# EAGLE design tinyek (EAGLE 6.5.0)
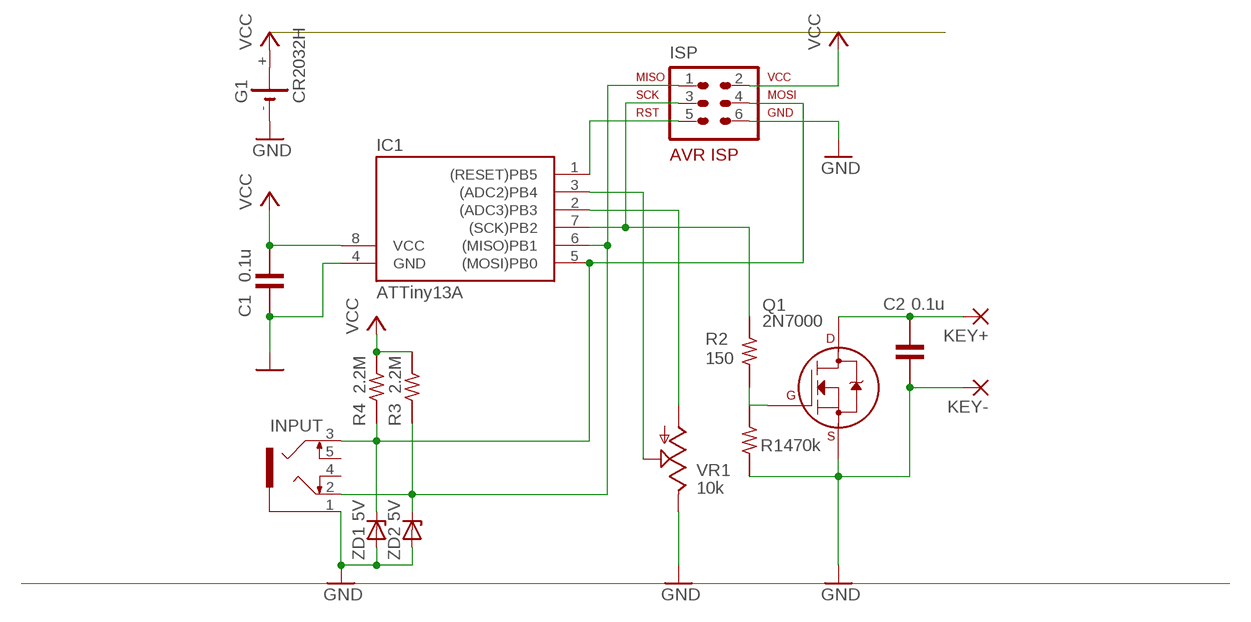
[diagram p0: schematic, sheet 1]

## Parts
C1  0.1u  C-50V-0302-5.08  [50-0302-5.08]
C2  0.1u  C-50V-0302-5.08  [50-0302-5.08]
G1  CR2032H  [CR2032H]
IC1  ATTiny13A  TINY138P3  [DIL08]
INPUT  1503_09  [1503_09]
ISP  AVR-ISP-6VERT  [AVR-ISP-6]
KEY+  2,15/1,0  [2,15/1,0]
KEY-  2,15/1,0  [2,15/1,0]
Q1  2N7000  2N7000_TO92  [TO-92]
R1  470k  R-1/4W-02.54-V  [1/4W-2.54V]
R2  150  R-1/4W-02.54-V  [1/4W-2.54V]
R3  2.2M  R-1/4W-07.62  [1/4W-7.62H]
R4  2.2M  R-1/4W-07.62  [1/4W-7.62H]
VR1  10k  TRIM_US-B25U  [B25U]
ZD1  5V  ZPD  [DO35Z10]
ZD2  5V  ZPD  [DO35Z10]

## Nets
GND: C1.PAD1 C2.PAD2 G1.- IC1.4(GND) INPUT.1 ISP.6 KEY-.1(P) Q1.1(S) R1.PAD2 VR1.E ZD1.A ZD2.A
N$1: IC1.1((RESET)PB5) ISP.5
N$4: IC1.7((SCK)PB2) ISP.3 R2.PAD1
N$5: IC1.2((ADC3)PB3) VR1.A
N$6: IC1.3((ADC2)PB4) VR1.S
N$8: Q1.2(G) R1.PAD1 R2.PAD2
N$9: C2.PAD1 KEY+.1(P) Q1.3(D)
N$10: IC1.5((MOSI)PB0) INPUT.3 ISP.4 R4.PAD2 ZD1.C
N$11: IC1.6((MISO)PB1) INPUT.2 ISP.1 R3.PAD2 ZD2.C
VCC: C1.PAD2 G1.+ IC1.8(VCC) ISP.2 R3.PAD1 R4.PAD1
Unconnected: G1.+@1(+) INPUT.4 INPUT.5

## Library data of the parts
C1 C2 = c-j:C-: CAPACITOR Japanese symbol
G1 = battery:CR2032H: LI BATTERY Varta
IC1 = avr-7:TINY13*
INPUT = con-lumberg:1503_09: Jack connectors according to JISC 6560, 3.5 mm Klinkeneinbaukupplung nach JISC 6560, 3,5 mm, 3-polig/ stereo, abgewinkelte Ausführung, mit 2 Öffnern und Lötaugen, für Leiterplatten Rückseitenmontage Source: http://www.lumberg.com/Produkte/PDFs/1503_09.pdf; OC_FARNELL: 1243244; OC_NEWARK: unknown
ISP = avr-7:AVR-ISP-6: AVR ISP-6 Serial Programming Header
KEY+ KEY- = wirepad:2,15/1,0: THROUGH-HOLE PAD
Q1 = transistors:2N700*: 2N7000, 2N7002, NDS7002A N-channel enhancement mode MOSFET
R1-R4 = r-j:R-: RESISTOR Japanese symbol
VR1 = pot:TRIM_US-: POTENTIOMETER
ZD1 ZD2 = diode:ZPD: Z DIODE 500 mW

## Net classes
0 default: width 0.762 mm

## Board
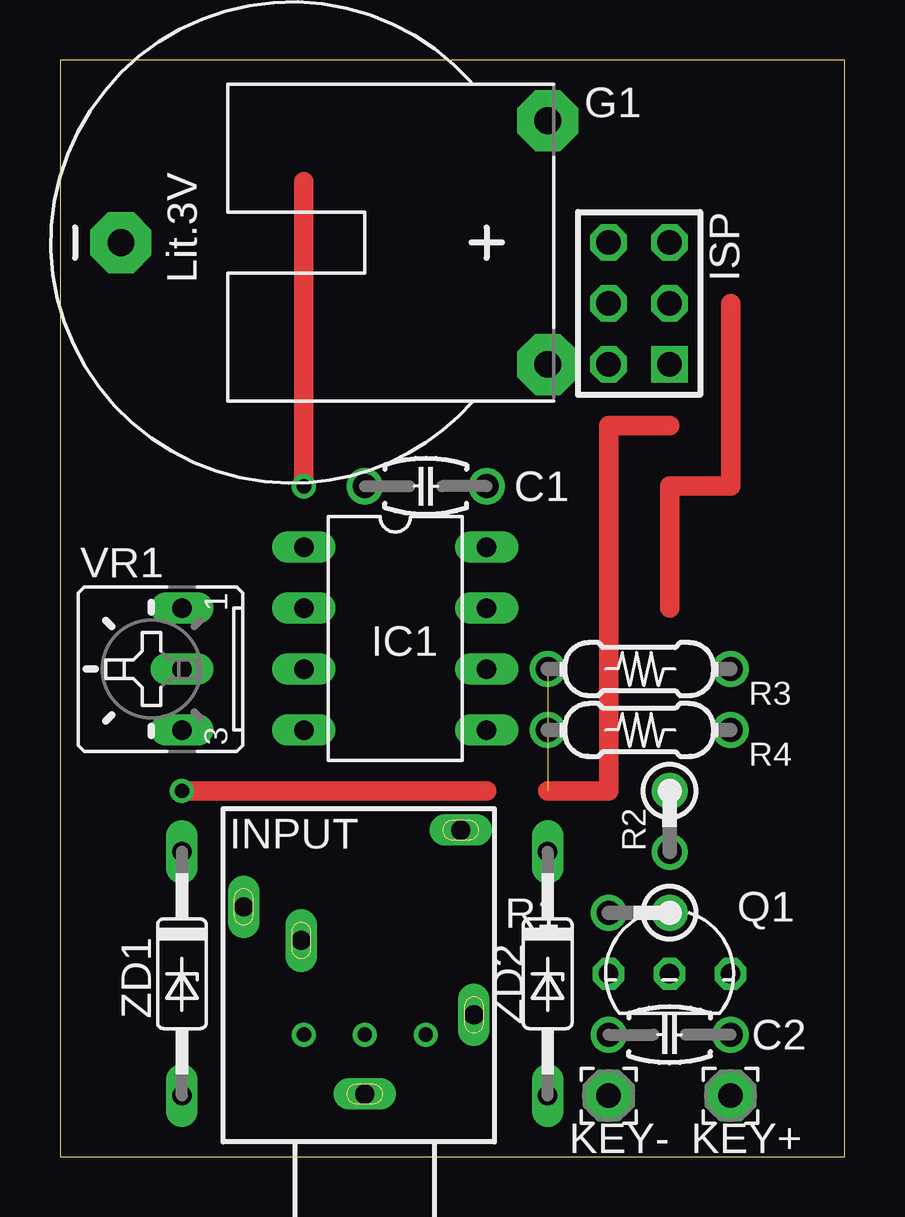
[diagram p1: board, top side]
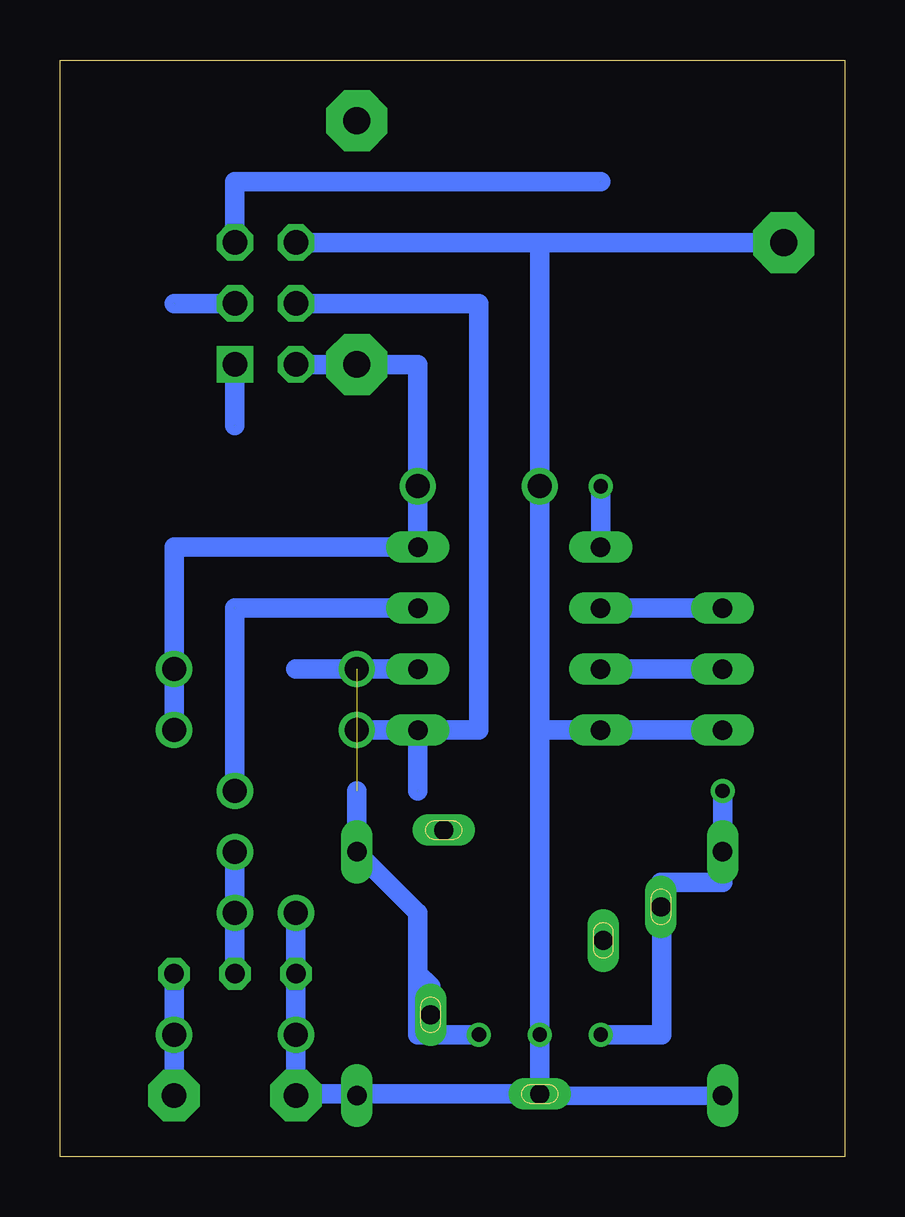
[diagram p2: board, bottom side, seen from below]

Size 32.69 x 45.71 mm. Coordinates in mm from the lower left corner, seen from the top.
Outline: 0,0 32.69,0 32.69,45.71 0,45.71 0,0
Copper layers (1*16): Top 0.035mm / dielectric 1.5mm / Bottom 0.035mm
Design rules "default": minimum track width 10mil, minimum drill 24mil, track to track 8mil, track to pad 8mil, pad to pad 8mil, via to via 8mil, smd to smd 8mil, copper to edge 40mil, drill to drill 8mil, minimum pad ring 10mil, minimum via ring 8mil, stop-mask expansion 4mil, vias tented up to drill 0mil, thermal gap 10mil
tRestrict: area 9.9,17.5 to 10.4,18; area 9.9,20.1 to 10.4,20.6; area 9.9,22.6 to 10.4,23.1; area 9.9,25.1 to 10.4,25.7; area 17.5,25.1 to 18,25.7; area 17.5,22.6 to 18,23.1; area 17.5,20.1 to 18,20.6; area 17.5,17.5 to 18,18; area 20.1,20.1 to 20.6,20.6; area 20.1,17.5 to 20.6,18; area 27.7,17.5 to 28.2,18; area 27.7,20.1 to 28.2,20.6; 258 more areas
bRestrict: area 11.2,11.2 to 11.7,11.7; area 11.2,13.7 to 11.7,14.2; area 13.7,11.2 to 14.2,11.7; area 13.7,13.7 to 14.2,14.2; area 13.7,13.7 to 14.2,14.2; area 16.3,11.2 to 16.8,11.7; area 16.3,13.7 to 16.8,14.2; area 18.8,11.2 to 19.3,11.7; area 18.8,13.7 to 19.3,14.2; area 18.8,13.7 to 19.3,14.2; area 11.2,16.3 to 11.7,16.8; area 11.2,18.8 to 11.7,19.3; 303 more areas

### Footprints (pad centres in the part's own frame; a part is rotated, then mirrored left to right if it is on the bottom)
50-0302-5.08 = drill 1: PAD1 -2.54,0; PAD2 2.54,0
CR2032H = drill 1.118 pad 2.54 octagon: + 5.08,10.795; +@1 -5.08,10.795; - 0,-6.985
DIL08 = drill 0.813 long: 1 -3.81,-3.81; 2 -1.27,-3.81; 3 1.27,-3.81; 4 3.81,-3.81; 5 3.81,3.81; 6 1.27,3.81; 7 -1.27,3.81; 8 -3.81,3.81
1503_09 = drill 0.8 pad 1.2 long: 1 0,-2.1; 2 -4.55,-5.4; 3 5.05,-9.9; 4 -4,-13.1; 5 2.65,-8.5
AVR-ISP-6 = drill 1.016 square: 1 -2.54,-1.27 | drill 1.016 octagon: 2 -2.54,1.27; 3 0,-1.27; 4 0,1.27; 5 2.54,-1.27; 6 2.54,1.27
2,15/1,0 = drill 1.016 pad 2.159 octagon: 1 0,0
TO-92 = drill 0.813 octagon: 1 -2.54,0; 2 0,0; 3 2.54,0
1/4W-2.54V = drill 1: PAD1 0,0; PAD2 2.54,0
1/4W-7.62H = drill 1: PAD1 -3.81,0; PAD2 3.81,0
B25U = drill 0.813 long: A 2.54,-0.889; E -2.54,-0.889; S 0,-0.889
DO35Z10 = drill 0.813 long: A 5.08,0; C -5.08,0

### Placement (x,y rotation side)
C1  15.24,27.94 0 top
C2  25.4,5.08 180 top
G1  9.53,38.1 270 top
IC1  13.97,21.59 270 top
INPUT  12.7,0.51 180 top
ISP  24.13,35.56 90 top
KEY+  27.94,2.54 0 top
KEY-  22.86,2.54 0 top
Q1  25.4,7.62 0 top
R1  25.4,10.16 180 top
R2  25.4,15.24 270 top
R3  24.13,20.32 180 top
R4  24.13,17.78 180 top
VR1  4.19,20.32 90 top
ZD1  5.08,7.62 270 top
ZD2  20.32,7.62 270 top

### Tracks (layer width: path | path; a pad name or v marks a point on that pad's centre or on a via)
GND  (via drill 0.6)
  Bottom 0.762: ZD1.A 12.7,2.54 INPUT.1 | ZD2.A 20.32,2.61
  Bottom 0.813: 12.7,17.78 C1.PAD1 12.7,38.1 | VR1.E IC1.4 12.7,17.78 | G1.- 12.7,38.1 | 12.7,17.78 v12.7,5.08 INPUT.1 20.32,2.61 22.86,2.61 KEY-.1 C2.PAD2 Q1.1 R1.PAD2 | ISP.6 12.7,38.1
N$1  (via drill 0.6)  (1 unrouted)
  Top 0.813: v10.16,27.94 10.16,40.64
  Bottom 0.813: ISP.5 25.4,40.64 10.16,40.64 | IC1.1 v10.16,27.94
N$4  (2 unrouted)
  Top 0.813: 27.94,35.56 27.94,27.94 25.4,27.94 25.4,22.86
  Bottom 0.813: IC1.7 25.4,22.86 R2.PAD1 | ISP.3 27.94,35.56
N$5
  Bottom 0.813: IC1.2 VR1.A
N$6
  Bottom 0.813: VR1.S IC1.3
N$7  (via drill 0.6)
  Bottom 0.813: v10.16,5.08 7.62,5.08 7.62,10.16
N$8
  Bottom 0.813: Q1.2 R1.PAD1 R2.PAD2
N$9
  Bottom 0.813: KEY+.1 C2.PAD1 Q1.3
N$10  (via drill 0.6)  (1 unrouted)
  Top 0.813: 17.78,15.24 v5.08,15.24
  Bottom 0.813: R4.PAD2 IC1.5 | IC1.5 15.24,17.78 15.24,35.56 ISP.4 | v5.08,15.24 ZD1.C 5.08,11.43 7.65,11.43 INPUT.3 | IC1.5 17.78,15.24
N$11  (via drill 0.6)  (3 unrouted)
  Top 0.813: 25.4,30.48 22.86,30.48 22.86,15.24 20.32,15.24
  Bottom 0.813: IC1.6 R3.PAD2 22.86,20.32 | ISP.1 25.4,30.48 | 20.32,15.24 ZD2.C 17.78,10.16 17.78,7.62 | INPUT.2 17.25,7.09 17.78,7.62 | v15.24,5.08 17.78,5.08 17.78,7.62
VCC
  Bottom 0.813: R3.PAD1 R4.PAD1 27.94,25.4 IC1.8 C1.PAD2 17.78,33.02 G1.+ ISP.2